# EAGLE schematic ioboard (EAGLE 4.13)
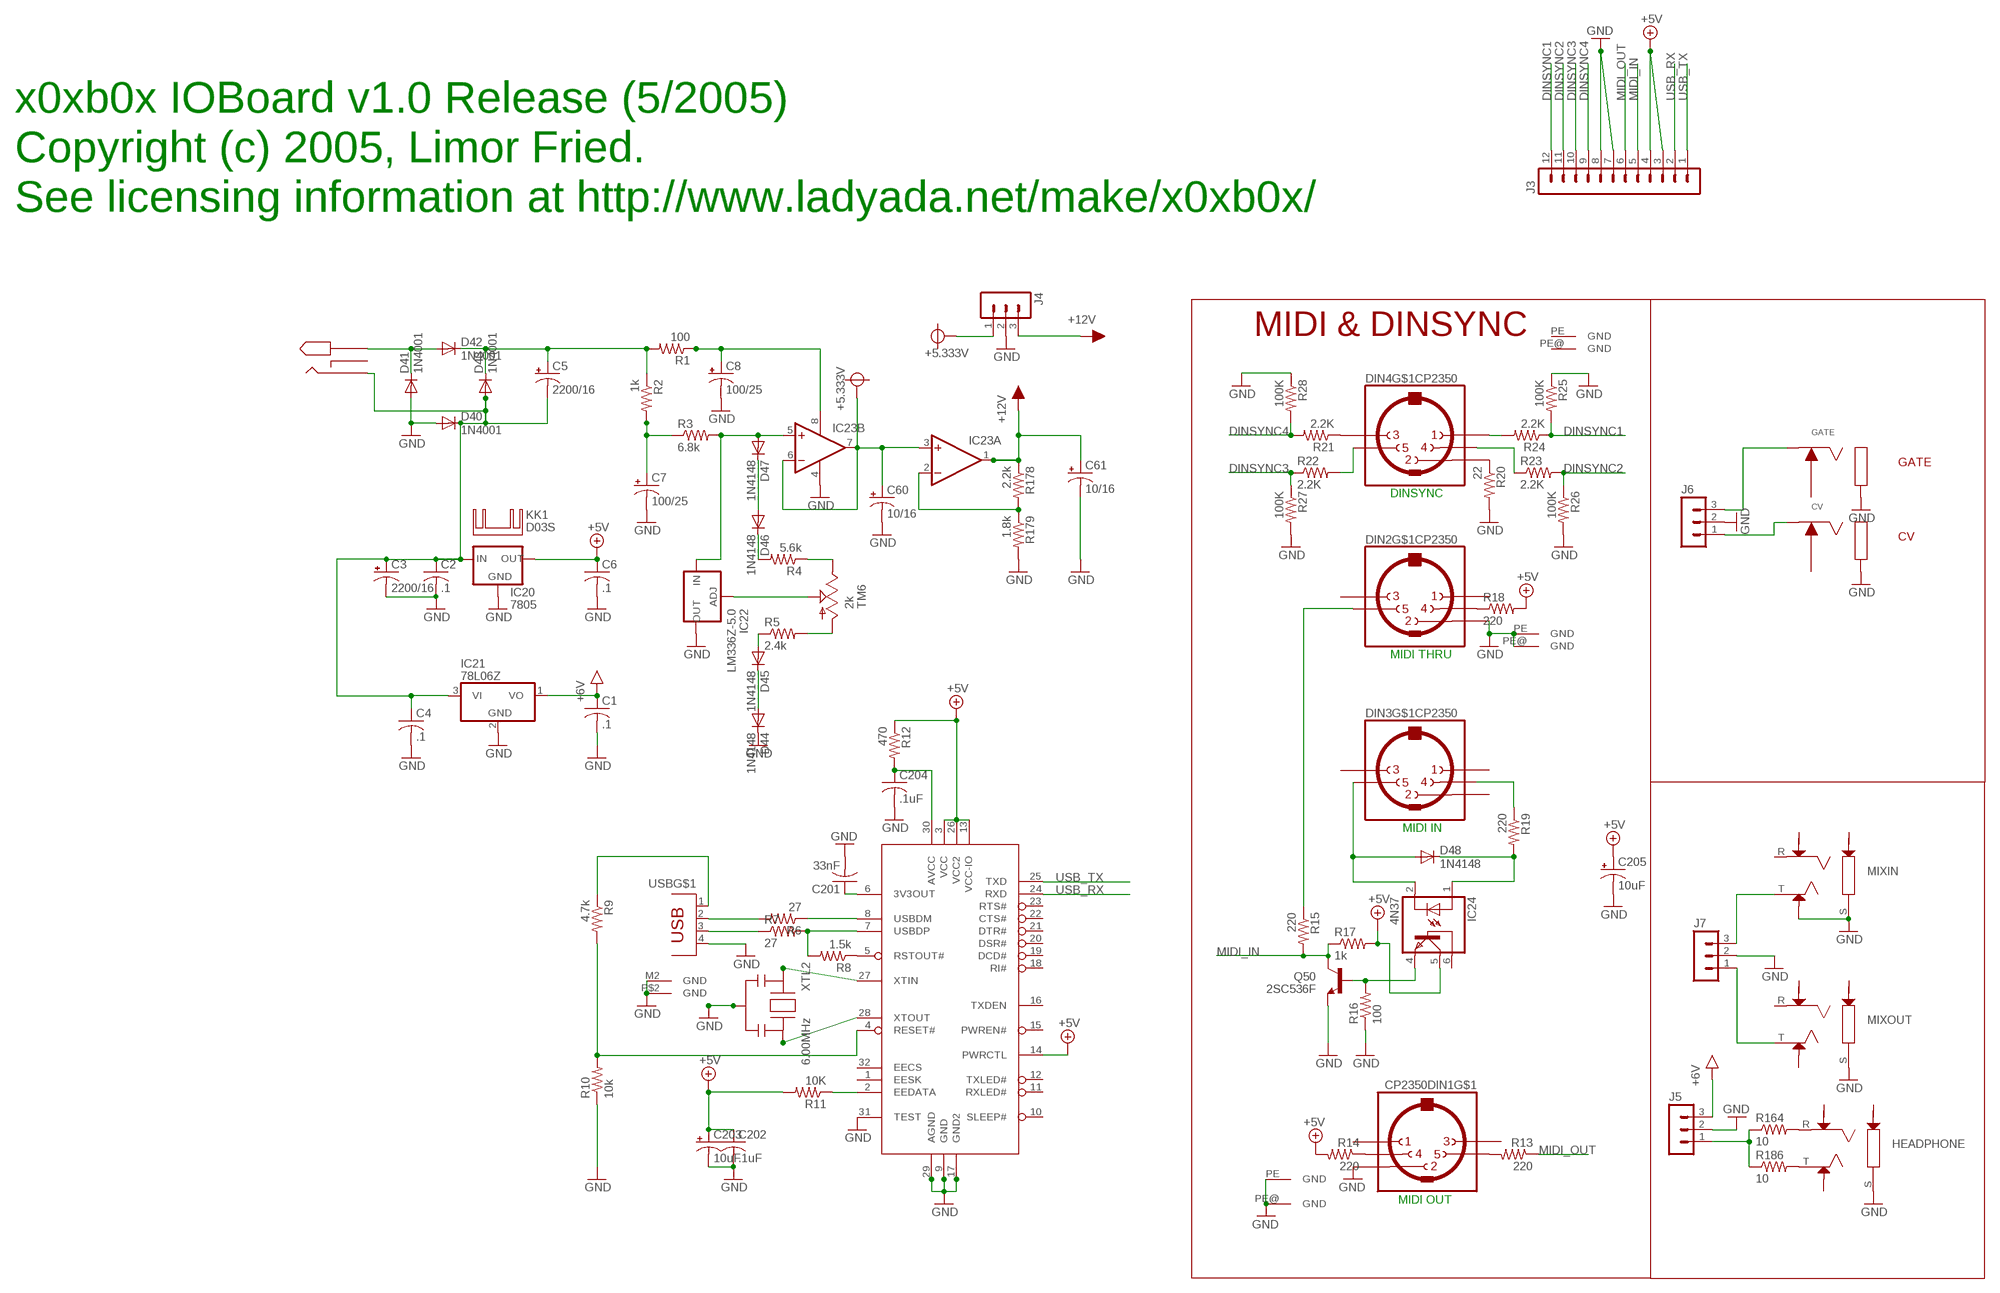
[diagram p0: schematic, sheet 1]

## Parts
C1  .1  C-US050H075X075  [C050H075X075]
C2  .1  C-US050H075X075  [C050H075X075]
C3  2200/16  CPOL-USE5-13  [E5-13]
C4  .1  C-US050H075X075  [C050H075X075]
C5  2200/16  CPOL-USE5-13  [E5-13]
C6  .1  C-US050H075X075  [C050H075X075]
C7  100/25  CPOL-USE5-6  [E5-6]
C8  100/25  CPOL-USE5-6  [E5-6]
C60  10/16  CPOL-USE5-6  [E5-6]
C61  10/16  CPOL-USE5-6  [E5-6]
C201  33nF  C-US050-025X075  [C050-025X075]
C202  .1uF  C-US050H075X075  [C050H075X075]
C203  10uF  CPOL-USE5-6  [E5-6]
C204  .1uF  C-US050H075X075  [C050H075X075]
C205  10uF  CPOL-USE5-6  [E5-6]
CV  MONO_CC  [CP-3502]
D40  1N4001  1N4004  [DO41-10]
D41  1N4001  1N4004  [DO41-10]
D42  1N4001  1N4004  [DO41-10]
D43  1N4001  1N4004  [DO41-10]
D44  1N4148  [DO35-10]
D45  1N4148  [DO35-10]
D46  1N4148  [DO35-10]
D47  1N4148  [DO35-10]
D48  1N4148  [DO35-10]
DIN1  CP2350  [CP-2350]
DIN2  CP2350  [CP-2350]
DIN3  CP2350  [CP-2350]
DIN4  CP2350  [CP-2350]
GATE  MONO_CC  [CP-3502]
HEADPHONE  NEUTRIX_STEREO  [REAN_1/4STERO]
IC20  7805  78XXS  [78XXS]
IC21  78L06Z  78L05Z  [TO92]
IC22  LM336Z-5.0  LM337LX0X  [2SC536F]
IC23  AN6562N  [DIL08]
IC24  4N37  [DIL06]
IC25  FT232  [SQFP-S-7X7-32]
J3  MA12-1  [MA12-1]
J4  MA03-1  [MA03-1]
J5  MA03-1  [MA03-1]
J6  MA03-1  [MA03-1]
J7  MA03-1  [MA03-1]
KK1  D03S  [D03S]
MIXIN  NEUTRIX_STEREO  [REAN_1/4STERO]
MIXOUT  NEUTRIX_STEREO  [REAN_1/4STERO]
POWER  2.1MMJACK  [PJ-102A]
Q50  2SC536F  [2SC536F]
R1  100  R-US_0207/5V  [0207/5V]
R2  1k  R-US_0207/5V  [0207/5V]
R3  6.8k  R-US_0207/5V  [0207/5V]
R4  5.6k  R-US_0207/5V  [0207/5V]
R5  2.4k  R-US_0207/5V  [0207/5V]
R6  27  R-US_0207/5V  [0207/5V]
R7  27  R-US_0207/5V  [0207/5V]
R8  1.5k  R-US_0207/5V  [0207/5V]
R9  4.7k  R-US_0207/5V  [0207/5V]
R10  10k  R-US_0207/5V  [0207/5V]
R11  10K  R-US_0207/5V  [0207/5V]
R12  470  R-US_0207/5V  [0207/5V]
R13  220  R-US_0207/5V  [0207/5V]
R14  220  R-US_0207/5V  [0207/5V]
R15  220  R-US_0207/5V  [0207/5V]
R16  100  R-US_0207/5V  [0207/5V]
R17  1k  R-US_0207/5V  [0207/5V]
R18  220  R-US_0207/5V  [0207/5V]
R19  220  R-US_0207/5V  [0207/5V]
R20  22  R-US_0207/5V  [0207/5V]
R21  2.2K  R-US_0207/5V  [0207/5V]
R22  2.2K  R-US_0207/5V  [0207/5V]
R23  2.2K  R-US_0207/5V  [0207/5V]
R24  2.2K  R-US_0207/5V  [0207/5V]
R25  100K  R-US_0207/5V  [0207/5V]
R26  100K  R-US_0207/5V  [0207/5V]
R27  100K  R-US_0207/5V  [0207/5V]
R28  100K  R-US_0207/5V  [0207/5V]
R164  10  R-US_0207/5V  [0207/5V]
R178  2.2k  R-US_0207/5V  [0207/5V]
R179  1.8k  R-US_0207/5V  [0207/5V]
R186  10  R-US_0207/5V  [0207/5V]
TM6  2k  TRIM_US-  [306]
USB  ACON_TYPEB  [PN61729]
XTL2  6.00MHz  ZTT  [ZTT_XTAL]

## Nets
+5.333V: C60.+ IC23.3(A:+IN) IC23.6(B:-IN) IC23.7(B:OUT) J4.1
+5V: C6.1 C202.1 C203.+ C205.+ IC20.OUT IC24.5(COL) IC25.3(VCC) IC25.13(VCC-IO) IC25.14(PWRCTL) IC25.26(VCC2) J3.3 J3.4 R11.2 R12.1 R14.2 R17.2 R18.2
+6V: C1.1 IC21.1(VO) J5.3
+12V: C61.+ IC23.1(A:OUT) J4.3 R178.1
DINSYNC1: J3.12 R24.1 R25.2
DINSYNC2: J3.11 R23.2 R26.1
DINSYNC3: J3.10 R22.1 R27.1
DINSYNC4: J3.9 R21.2 R28.2
GND: C1.2 C2.2 C3.- C4.2 C6.2 C7.- C8.- C60.- C61.- C201.2 C202.2 C203.- C204.2 C205.- CV.SLEEVE D40.A D41.A D44.C DIN1.2 DIN1.PE(GND) DIN1.PE@(GND) DIN2.2 DIN2.PE(GND) DIN2.PE@(GND) GATE.SLEEVE HEADPHONE.S IC20.GND IC21.2(GND) IC22.3(OUT) IC23.4(P:V-) IC25.9(GND) IC25.17(GND2) IC25.29(AGND) IC25.31(TEST) J3.7 J3.8 J4.2 J5.2 J6.2 J7.2 MIXIN.S MIXIN.TN MIXOUT.S Q50.3(E) R10.1 R16.1 R20.2 R25.1 R26.2 R27.2 R28.1 R179.2 USB.4 USB.M2(GND) USB.P$2(GND) XTL2.P$2(GND)
HP_OUT: J5.1 R164.1 R186.1
MIDI_IN: J3.5 Q50.2(C) R15.2 R17.1
MIDI_OUT: J3.6 R13.1
N$1: J7.1 MIXOUT.T
N$2: J7.3 MIXIN.T
N$3: C8.+ IC23.8(P:V+) R1.1
N$4: D47.A IC22.2(IN) IC23.5(B:+IN) R3.2
N$5: IC23.2(A:-IN) R178.2 R179.1
N$6: C7.+ R2.2 R3.1
N$7: R4.1 TM6.3(E)
N$8: R5.2 TM6.1(A)
N$9: D46.A D47.C
N$10: D46.C R4.2
N$11: D45.A R5.1
N$12: D44.A D45.C
N$13: IC22.1(ADJ) TM6.2(S)
N$14: R9.1 USB.1
N$15: D41.C D42.A POWER.P$1
N$16: C5.+ D42.C D43.C R1.2 R2.1
N$17: C2.1 C3.+ C4.1 C5.- D40.C D43.A IC20.IN IC21.3(VI) POWER.P$2
N$18: IC24.4(EMI) Q50.1(B) R16.2
N$19: IC25.27(XTIN) XTL2.P$1(IN)
N$20: IC25.28(XTOUT) XTL2.P$3(OUT)
N$21: IC25.4(RESET#) R9.2 R10.2
N$22: DIN4.3 R21.1
N$23: DIN4.5 R22.2
N$24: DIN4.1 R24.2
N$25: DIN4.4 R23.1
N$26: GATE.TIP J6.3
N$27: CV.TIP J6.1
N$28: HEADPHONE.R R164.2
N$29: HEADPHONE.T R186.2
N$78: DIN4.2 R20.1
N$87: D48.A DIN3.5 IC24.2(C)
N$90: D48.C IC24.1(A) R19.2
N$234: DIN3.4 R19.1
N$293: DIN2.5 R15.1
N$294: DIN2.4 R18.1
N$295: DIN1.5 R13.2
N$296: DIN1.4 R14.1
N$307: R6.2 USB.2
N$309: R7.1 USB.3
N$310: IC25.7(USBDP) R7.2 R8.2
N$311: IC25.8(USBDM) R6.1
N$312: IC25.5(RSTOUT#) R8.1
N$313: C201.1 IC25.6(3V3OUT)
N$314: C204.1 IC25.30(AVCC) R12.2
N$315: IC25.2(EEDATA) R11.1
USB_RX: IC25.24(RXD) J3.2
USB_TX: IC25.25(TXD) J3.1
Unconnected: CV.TIPSHUNT DIN1.1 DIN1.3 DIN2.1 DIN2.3 DIN3.1 DIN3.2 DIN3.3 DIN3.PE(GND) DIN3.PE@(GND) DIN4.PE(GND) DIN4.PE@(GND) GATE.TIPSHUNT HEADPHONE.RN HEADPHONE.SN HEADPHONE.TN IC24.6(BAS) IC25.1(EESK) IC25.10(SLEEP#) IC25.11(RXLED#) IC25.12(TXLED#) IC25.15(PWREN#) IC25.16(TXDEN) IC25.18(RI#) IC25.19(DCD#) IC25.20(DSR#) IC25.21(DTR#) IC25.22(CTS#) IC25.23(RTS#) IC25.32(EECS) MIXIN.R MIXIN.RN MIXIN.SN MIXOUT.R MIXOUT.RN MIXOUT.SN MIXOUT.TN POWER.P$3

## Notes on the sheet
- x0xb0x IOBoard v1.0 Release (5/2005)
- Copyright (c) 2005, Limor Fried.
- See licensing information at http://www.ladyada.net/make/x0xb0x/
- MIDI & DINSYNC
- GATE
- DINSYNC
- CV
- MIDI THRU
- MIDI IN
- MIDI OUT

## Library data of the parts
C1 C2 C4 C6 C201 C202 C204 = rcl:C-US: CAPACITOR, American symbol
C3 C5 C7 C8 C60 C61 C203 C205 = rcl:CPOL-US: POLARIZED CAPACITOR, American symbol
CV GATE = 303parts:MONO_CC
D40-D43 = diode:1N4004: DIODE general purpose rectifier, 1 A
D44-D48 = diode:1N4148: DIODE high speed (Philips)
DIN1-DIN4 = 303parts:CP2350
HEADPHONE MIXIN MIXOUT = 303parts:NEUTRIX_STEREO
IC20 = v-reg:78XXS: VOLTAGE REGULATOR
IC21 = linear:78*: Positive VOLTAGE REGULATOR
IC22 = v-reg:LM337L: VOLTAGE REGULATOR
IC23 = 303parts:AN6562: OP AMP
IC24 = optocoupler:4N37: MOTOROLA OPTO COUPLER
IC25 = usbtoys:FT232
J3 = con-lstb:MA12-1: PIN HEADER
J4-J7 = con-lstb:MA03-1: PIN HEADER
KK1 = heatsink:D03S: HEATSINK distributor Schukat
POWER = 303parts:2.1MMJACK
Q50 = 303parts:2SC536F
R1-R28 R164 R178 R179 R186 = rcl:R-US_: RESISTOR, American symbol
TM6 = 303parts:TRIM_US-: POTENTIOMETER
USB = 303parts:ACON_TYPEB: BERG USB connector
XTL2 = usbtoys:ZTT